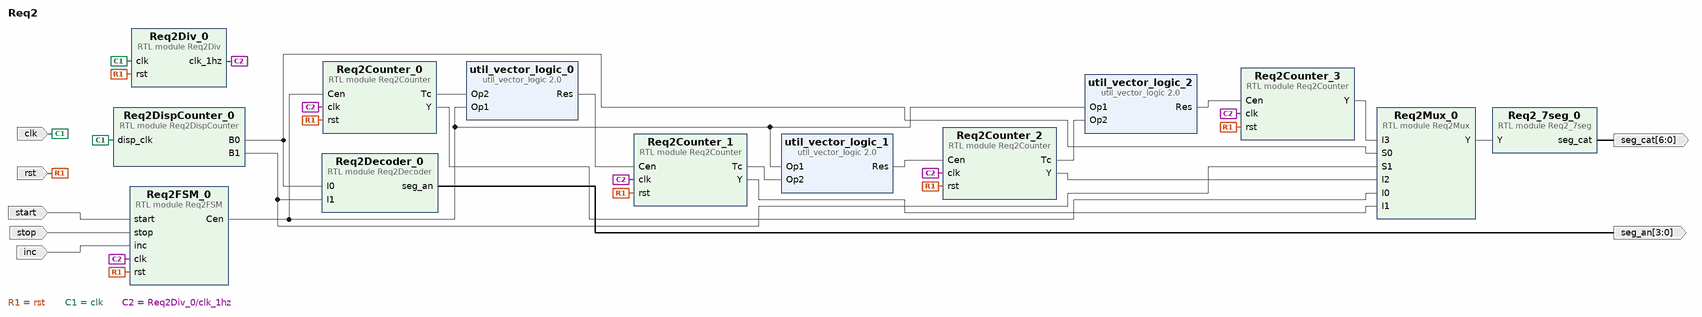
[diagram p0: block diagram of the top level]
# Vivado block design Req2, xc7z007sclg400-1, Vivado 2020.2
create_bd_design Req2

create_bd_port -dir O -from 6 -to 0 seg_cat
create_bd_port -dir O -from 3 -to 0 seg_an
create_bd_port -dir I -type clk clk
create_bd_port -dir I -type rst rst
create_bd_port -dir I start
create_bd_port -dir I stop
create_bd_port -dir I inc

create_bd_cell -type module -reference Req2DispCounter Req2DispCounter_0
create_bd_cell -type module -reference Req2Mux Req2Mux_0
create_bd_cell -type ip -vlnv xilinx.com:ip:util_vector_logic:2.0 util_vector_logic_0
set_property -dict {CONFIG.C_SIZE 1} [get_bd_cells util_vector_logic_0]
create_bd_cell -type ip -vlnv xilinx.com:ip:util_vector_logic:2.0 util_vector_logic_1
set_property -dict {CONFIG.C_SIZE 1} [get_bd_cells util_vector_logic_1]
create_bd_cell -type ip -vlnv xilinx.com:ip:util_vector_logic:2.0 util_vector_logic_2
set_property -dict {CONFIG.C_SIZE 1} [get_bd_cells util_vector_logic_2]
create_bd_cell -type module -reference Req2_7seg Req2_7seg_0
create_bd_cell -type module -reference Req2Decoder Req2Decoder_0
create_bd_cell -type module -reference Req2Counter Req2Counter_0
create_bd_cell -type module -reference Req2Counter Req2Counter_1
create_bd_cell -type module -reference Req2Counter Req2Counter_2
create_bd_cell -type module -reference Req2Counter Req2Counter_3
create_bd_cell -type module -reference Req2Div Req2Div_0
create_bd_cell -type module -reference Req2FSM Req2FSM_0

# ---- connections ----

connect_bd_net [get_bd_pins Req2DispCounter_0/B0] [get_bd_pins Req2Mux_0/S0] [get_bd_pins Req2Decoder_0/I0]
connect_bd_net [get_bd_pins Req2DispCounter_0/B1] [get_bd_pins Req2Mux_0/S1] [get_bd_pins Req2Decoder_0/I1]
connect_bd_net [get_bd_pins Req2Mux_0/Y] [get_bd_pins Req2_7seg_0/Y]
connect_bd_net [get_bd_pins Req2_7seg_0/seg_cat] [get_bd_ports seg_cat]
connect_bd_net [get_bd_pins Req2Decoder_0/seg_an] [get_bd_ports seg_an]
connect_bd_net -net rst_0_1 [get_bd_ports rst] \
  [get_bd_pins Req2Counter_0/rst] [get_bd_pins Req2Counter_1/rst] [get_bd_pins Req2Counter_2/rst] \
  [get_bd_pins Req2Counter_3/rst] [get_bd_pins Req2Div_0/rst] [get_bd_pins Req2FSM_0/rst]
connect_bd_net -net start_0_1 [get_bd_ports start] [get_bd_pins Req2FSM_0/start]
connect_bd_net -net stop_0_1 [get_bd_ports stop] [get_bd_pins Req2FSM_0/stop]
connect_bd_net -net inc_0_1 [get_bd_ports inc] [get_bd_pins Req2FSM_0/inc]
connect_bd_net [get_bd_pins Req2Counter_0/Y] [get_bd_pins Req2Mux_0/I0]
connect_bd_net [get_bd_pins Req2Counter_3/Y] [get_bd_pins Req2Mux_0/I3]
connect_bd_net [get_bd_pins util_vector_logic_0/Res] [get_bd_pins Req2Counter_1/Cen]
connect_bd_net [get_bd_pins Req2Counter_0/Tc] [get_bd_pins util_vector_logic_0/Op2]
connect_bd_net [get_bd_pins Req2FSM_0/Cen] \
  [get_bd_pins util_vector_logic_0/Op1] [get_bd_pins util_vector_logic_1/Op1] [get_bd_pins util_vector_logic_2/Op1] \
  [get_bd_pins Req2Counter_0/Cen]
connect_bd_net [get_bd_pins Req2Counter_1/Tc] [get_bd_pins util_vector_logic_1/Op2]
connect_bd_net [get_bd_pins util_vector_logic_1/Res] [get_bd_pins Req2Counter_2/Cen]
connect_bd_net [get_bd_pins util_vector_logic_2/Res] [get_bd_pins Req2Counter_3/Cen]
connect_bd_net [get_bd_pins Req2Counter_2/Tc] [get_bd_pins util_vector_logic_2/Op2]
connect_bd_net [get_bd_ports clk] [get_bd_pins Req2DispCounter_0/disp_clk] [get_bd_pins Req2Div_0/clk]
connect_bd_net [get_bd_pins Req2Div_0/clk_1hz] \
  [get_bd_pins Req2Counter_0/clk] [get_bd_pins Req2Counter_1/clk] [get_bd_pins Req2Counter_2/clk] \
  [get_bd_pins Req2Counter_3/clk] [get_bd_pins Req2FSM_0/clk]
connect_bd_net [get_bd_pins Req2Counter_1/Y] [get_bd_pins Req2Mux_0/I1]
connect_bd_net [get_bd_pins Req2Counter_2/Y] [get_bd_pins Req2Mux_0/I2]

validate_bd_design
save_bd_design
